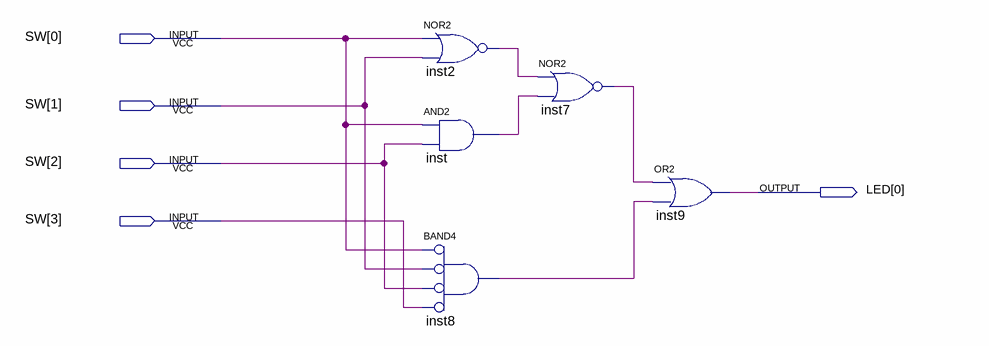
[diagram p0: schematic sheet]
// Quartus schematic lab_01.bdf as structural Verilog: 5 symbols, 5 pins
module lab_01 (
  input  [3:0] SW,
  output [0:0] LED
);

  wire inst2_out, inst7_out, inst8_out, inst_out;

  nor inst2 (inst2_out, SW[0], SW[1]);
  and inst (inst_out, SW[0], SW[2]);
  and inst8 (inst8_out, ~SW[0], ~SW[1], ~SW[2], ~SW[3]);  // BAND4
  nor inst7 (inst7_out, inst2_out, inst_out);
  or inst9 (LED[0], inst7_out, inst8_out);
endmodule
